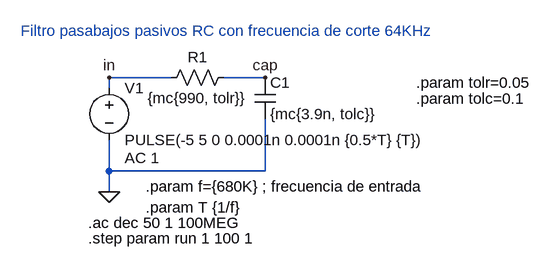
[diagram p0: schematic simulacion filtro pasabajos rc 64k.asc]
simulacion filtro pasabajos rc 64k.asc, the LTspice schematic file:
Version 4
SHEET 1 880 680
WIRE 160 128 64 128
WIRE 304 128 240 128
WIRE 64 144 64 128
WIRE 64 272 64 224
WIRE 304 272 304 192
WIRE 304 272 64 272
WIRE 64 304 64 272
FLAG 64 304 0
FLAG 304 128 cap
FLAG 64 128 in
SYMBOL res 256 112 R90
WINDOW 0 0 56 VBottom 2
WINDOW 3 32 56 VTop 2
SYMATTR InstName R1
SYMATTR Value {mc{990, tolr}}
SYMBOL cap 288 128 R0
SYMATTR InstName C1
SYMATTR Value {mc{3.9n, tolc}}
SYMBOL voltage 64 128 R0
WINDOW 123 24 124 Left 2
WINDOW 39 24 152 Left 2
SYMATTR Value2 AC 1
SYMATTR InstName V1
SYMATTR Value PULSE(-5 5 0 0.0001n 0.0001n {0.5*T} {T})
TEXT 120 296 Left 2 !.param f={680K} ; frecuencia de entrada
TEXT 120 328 Left 2 !.param T {1/f}
TEXT 32 352 Left 2 !.ac dec 50 1 100MEG
TEXT -72 56 Left 2 ;Filtro pasabajos pasivos RC con frecuencia de corte 64KHz
TEXT 536 136 Left 2 !.param tolr=0.05
TEXT 536 160 Left 2 !.param tolc=0.1
TEXT 32 376 Left 2 !.step param run 1 100 1

The netlist it stands for:
* simulacion filtro pasabajos rc 64k.asc
R1 cap in {mc{990, tolr}}
C1 cap 0 {mc{3.9n, tolc}}
V1 in 0 PULSE(-5 5 0 0.0001n 0.0001n {0.5*T} {T}) AC 1
.param f={680K} ; frecuencia de entrada
.param T {1/f}
.ac dec 50 1 100MEG
* Filtro pasabajos pasivos RC con frecuencia de corte 64KHz
.param tolr=0.05
.param tolc=0.1
.step param run 1 100 1
.backanno
.end